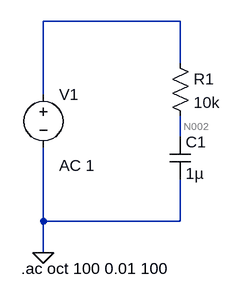
[diagram p0: schematic T3_1_RC_ac.asc]
T3_1_RC_ac.asc, the LTspice schematic file:
Version 4
SHEET 1 880 680
WIRE 352 -32 144 -32
WIRE 352 32 352 -32
WIRE 144 80 144 -32
WIRE 352 144 352 112
WIRE 144 272 144 160
WIRE 352 272 352 208
WIRE 352 272 144 272
WIRE 144 320 144 272
FLAG 144 320 0
SYMBOL voltage 144 64 R0
WINDOW 123 24 124 Left 2
WINDOW 39 0 0 Left 0
SYMATTR InstName V1
SYMATTR Value ""
SYMATTR Value2 AC 1
SYMBOL cap 336 144 R0
SYMATTR InstName C1
SYMATTR Value 1µ
SYMBOL res 336 16 R0
SYMATTR InstName R1
SYMATTR Value 10k
TEXT 110 344 Left 2 !.ac oct 100 0.01 100

The netlist it stands for:
* T3_1_RC_ac.asc
V1 N001 0 AC 1
C1 N002 0 1µ
R1 N001 N002 10k
.ac oct 100 0.01 100
.backanno
.end

* Results of the author's LTspice run, read from the files saved beside the schematic
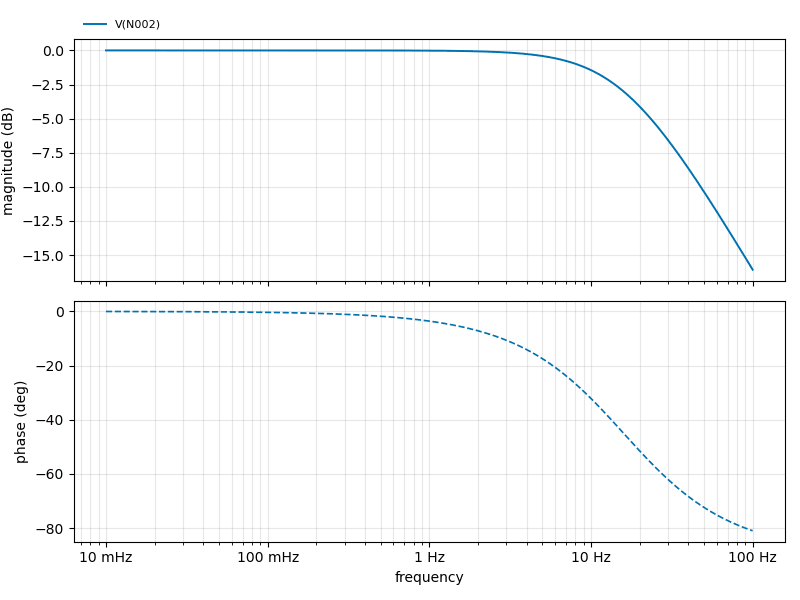
[diagram p1: AC Analysis of T3_1_RC_ac.asc, plotted from the saved traces]
* AC Analysis, 1 run:
*   V(N002): -0.00 dB at 10 mHz, -16.07 dB at 100 Hz, peak -0.00 dB at 10 mHz, 3 dB below the peak at 15.92 Hz